# EAGLE design adi-interface(v1) (EAGLE 7.1.0)
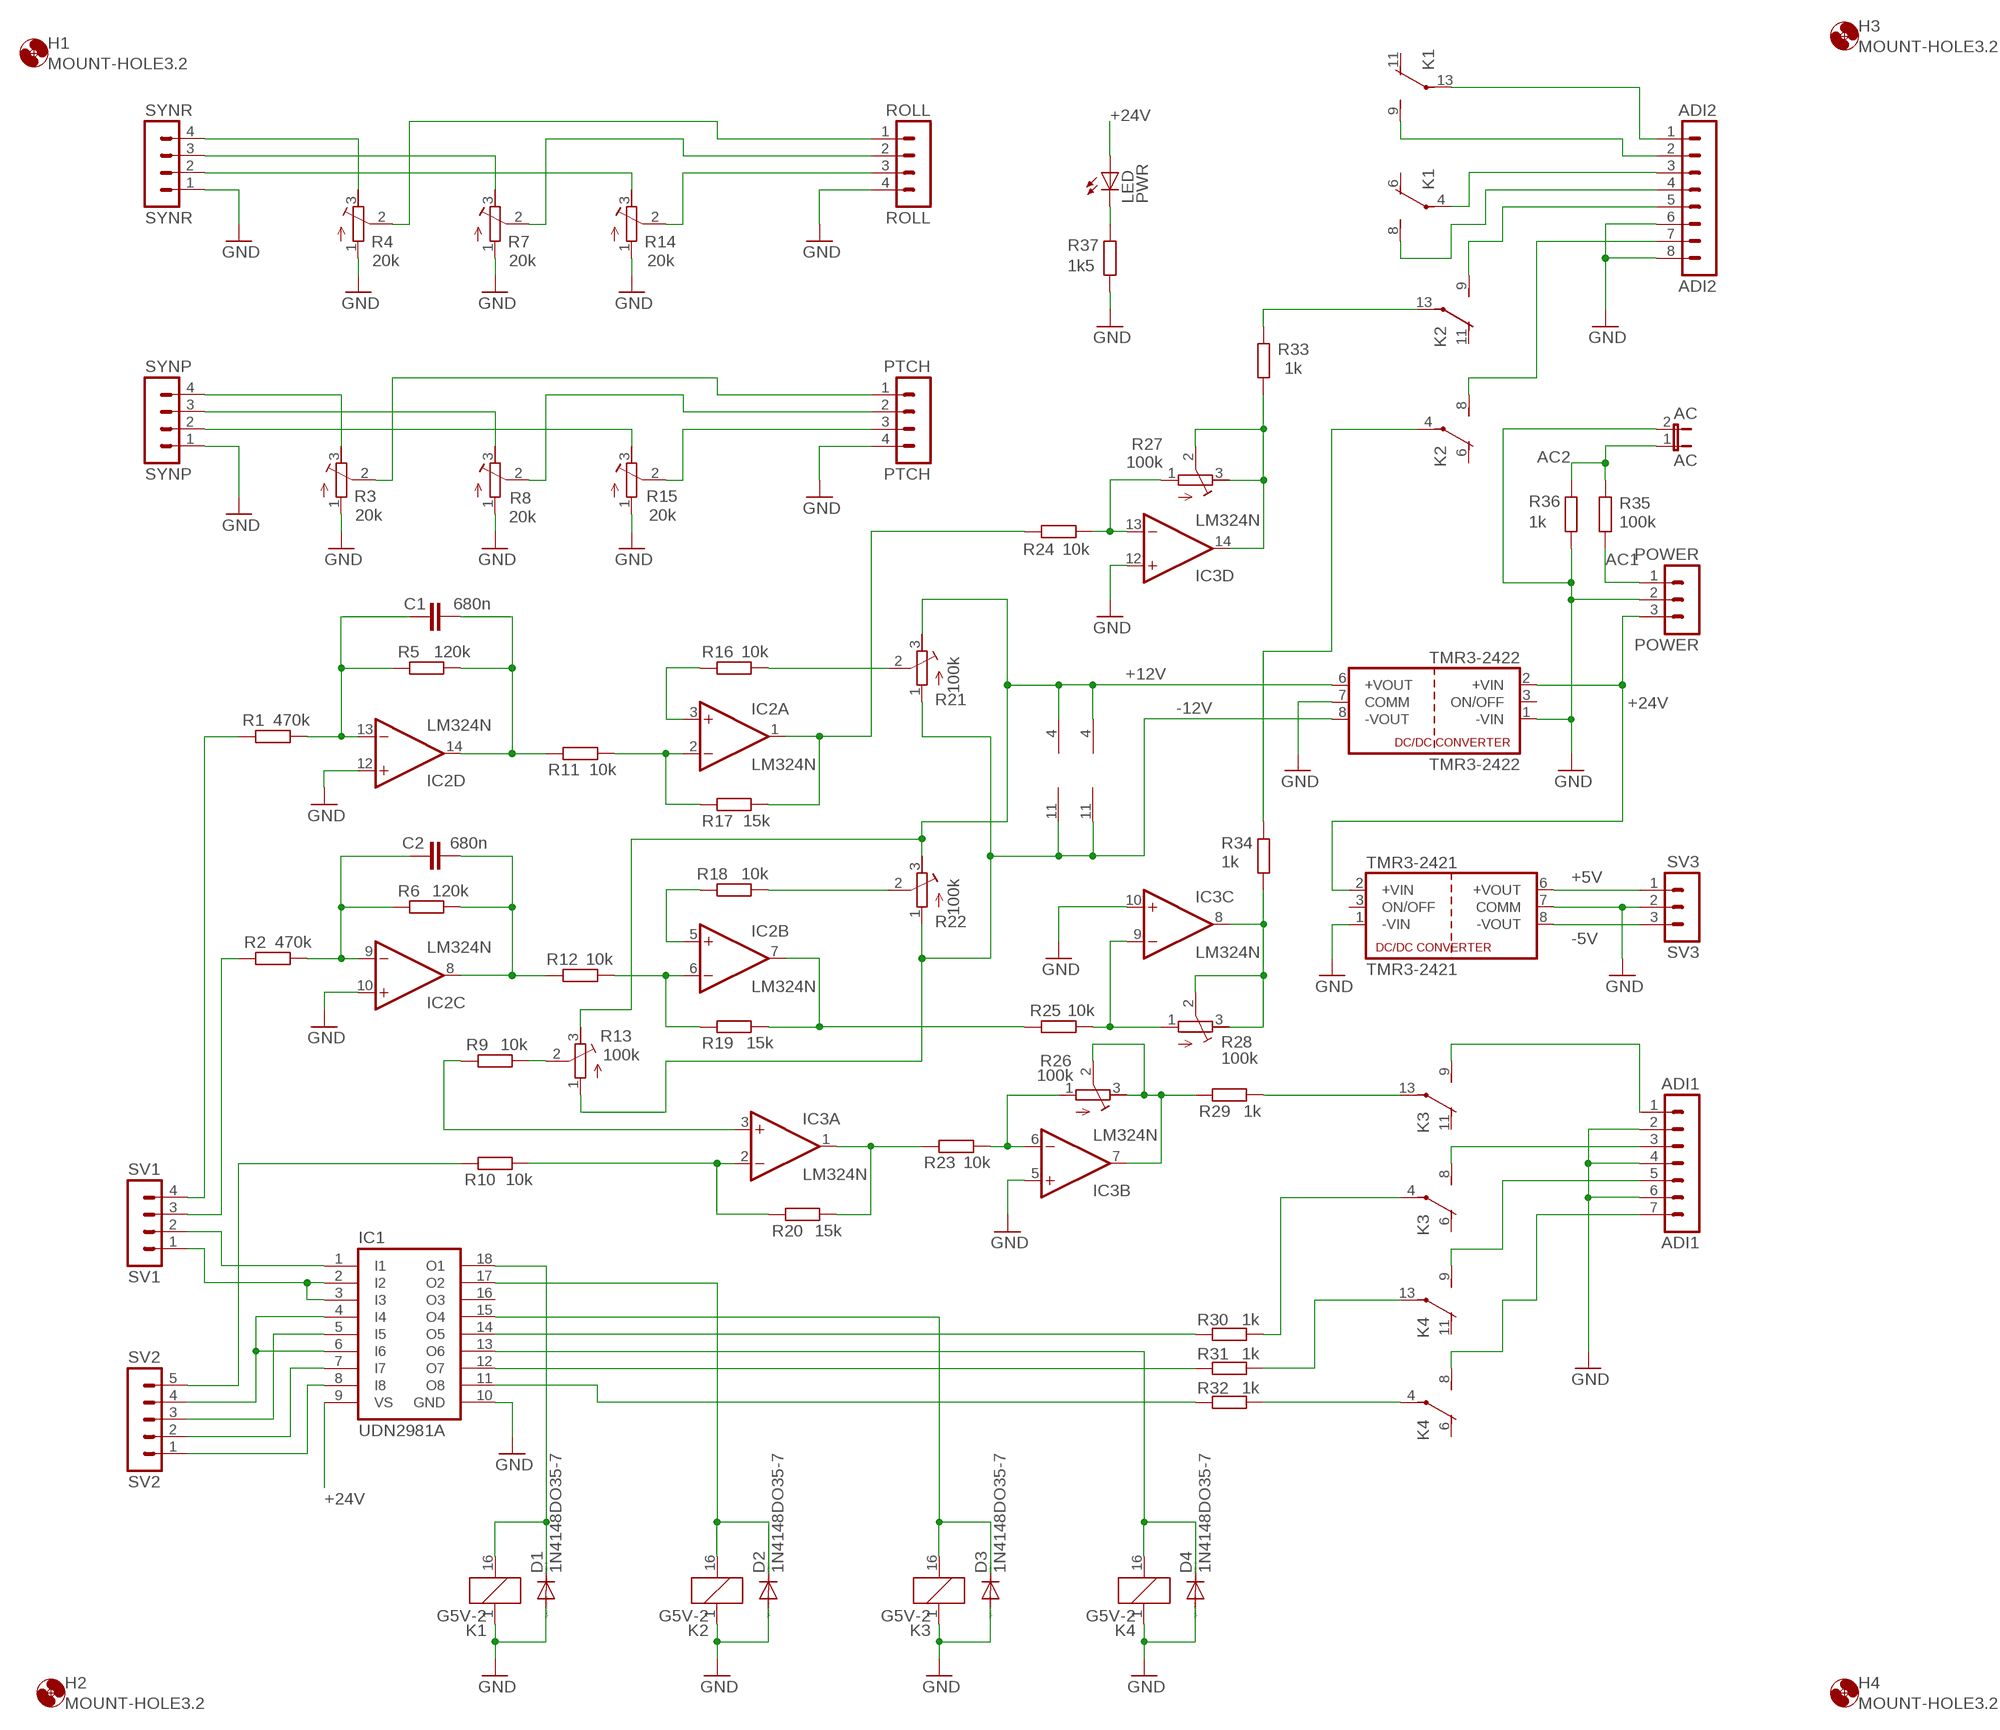
[diagram p0: schematic, sheet 1]

## Parts
AC  AC  JUMPER-2PTH  [1X02]
ADI1  ADI1  MA07-1  [MA07-1]
ADI2  ADI2  MA08-1  [MA08-1]
C1  680n  C-EU050-035X075  [C050-035X075]
C2  680n  C-EU050-035X075  [C050-035X075]
D1  1N4148DO35-7  [DO35-7]
D2  1N4148DO35-7  [DO35-7]
D3  1N4148DO35-7  [DO35-7]
D4  1N4148DO35-7  [DO35-7]
H1  MOUNT-HOLE3.2  [3,2]
H2  MOUNT-HOLE3.2  [3,2]
H3  MOUNT-HOLE3.2  [3,2]
H4  MOUNT-HOLE3.2  [3,2]
IC1  UDN2981A  [DIL18]
IC2  LM324N  [DIL14]
IC3  LM324N  [DIL14]
K1  G5V-2  [G5V-2]
K2  G5V-2  [G5V-2]
K3  G5V-2  [G5V-2]
K4  G5V-2  [G5V-2]
LED  PWR  LED3MM  [LED3MM]
POWER  POWER  MA03-1  [MA03-1]
PTCH  PTCH  MA04-1  [MA04-1]
R1  470k  R-EU_0204/7  [0204/7]
R2  470k  R-EU_0204/7  [0204/7]
R3  20k  R-TRIMM64Z  [RTRIM64Z]
R4  20k  R-TRIMM64Z  [RTRIM64Z]
R5  120k  R-EU_0204/7  [0204/7]
R6  120k  R-EU_0204/7  [0204/7]
R7  20k  R-TRIMM64Z  [RTRIM64Z]
R8  20k  R-TRIMM64Z  [RTRIM64Z]
R9  10k  R-EU_0204/7  [0204/7]
R10  10k  R-EU_0204/7  [0204/7]
R11  10k  R-EU_0204/7  [0204/7]
R12  10k  R-EU_0204/7  [0204/7]
R13  100k  R-TRIMM64Z  [RTRIM64Z]
R14  20k  R-TRIMM64Z  [RTRIM64Z]
R15  20k  R-TRIMM64Z  [RTRIM64Z]
R16  10k  R-EU_0204/7  [0204/7]
R17  15k  R-EU_0204/7  [0204/7]
R18  10k  R-EU_0204/7  [0204/7]
R19  15k  R-EU_0204/7  [0204/7]
R20  15k  R-EU_0204/7  [0204/7]
R21  100k  R-TRIMM64Z  [RTRIM64Z]
R22  100k  R-TRIMM64Z  [RTRIM64Z]
R23  10k  R-EU_0204/7  [0204/7]
R24  10k  R-EU_0204/7  [0204/7]
R25  10k  R-EU_0204/7  [0204/7]
R26  100k  R-TRIMM64Z  [RTRIM64Z]
R27  100k  R-TRIMM64Z  [RTRIM64Z]
R28  100k  R-TRIMM64Z  [RTRIM64Z]
R29  1k  R-EU_0204/7  [0204/7]
R30  1k  R-EU_0204/7  [0204/7]
R31  1k  R-EU_0204/7  [0204/7]
R32  1k  R-EU_0204/7  [0204/7]
R33  1k  R-EU_0204/7  [0204/7]
R34  1k  R-EU_0204/7  [0204/7]
R35  100k  R-EU_0204/7  [0204/7]
R36  1k  R-EU_0204/7  [0204/7]
R37  1k5  R-EU_0204/7  [0204/7]
ROLL  ROLL  MA04-1  [MA04-1]
SV1  SV1  MA04-1  [MA04-1]
SV2  SV2  MA05-1  [MA05-1]
SV3  SV3  MA03-1  [MA03-1]
SYNP  SYNP  MA04-1  [MA04-1]
SYNR  SYNR  MA04-1  [MA04-1]
TMR3-2421  TMR3-2421  TMR  [TRACO_SIP-8]
TMR3-2422  TMR3-2422  TMR  [TRACO_SIP-8]

## Nets
+5V [+5V]: SV3.1 TMR3-2421.6(+VOUT)
+12V [+12V]: IC2.4(P:V+) IC3.4(P:V+) R13.3(E) R21.3(E) R22.3(E) TMR3-2422.6(+VOUT)
+24V [+24V]: IC1.9(VS) LED.A POWER.3 TMR3-2421.2(+VIN) TMR3-2422.2(+VIN)
-5V [-5V]: SV3.3 TMR3-2421.8(-VOUT)
-12V [-12V]: IC2.11(P:V-) IC3.11(P:V-) R13.1(A) R21.1(A) R22.1(A) TMR3-2422.8(-VOUT)
AC1 [AC1]: POWER.1 R35.1
AC2 [AC2]: AC.1 R35.2 R36.2
GND [GND]: AC.2 ADI1.2 ADI1.4 ADI1.6 ADI2.6 ADI2.8 D1.A D2.A D3.A D4.A IC1.10(GND) IC2.10(C:+IN) IC2.12(D:+IN) IC3.5(B:+IN) IC3.10(C:+IN) IC3.12(D:+IN) K1.1 K2.1 K3.1 K4.1 POWER.2 PTCH.4 R3.1(A) R4.1(A) R7.1(A) R8.1(A) R14.1(A) R15.1(A) R36.1 R37.1 ROLL.4 SV3.2 SYNP.1 SYNR.1 TMR3-2421.1(-VIN) TMR3-2421.7(COMM) TMR3-2422.1(-VIN) TMR3-2422.7(COMM)
N$1: R14.3(E) SYNR.2
N$2: R7.3(E) SYNR.3
N$3: R4.3(E) SYNR.4
N$4: R3.3(E) SYNP.4
N$5: R8.3(E) SYNP.3
N$6: R15.3(E) SYNP.2
N$7: R14.2(S) ROLL.3
N$8: R7.2(S) ROLL.2
N$9: R4.2(S) ROLL.1
N$10: PTCH.3 R15.2(S)
N$11: PTCH.2 R8.2(S)
N$12: PTCH.1 R3.2(S)
N$13: ADI2.1 K1.13(2:P)
N$14: ADI2.2 K1.9(2:S)
N$15: ADI2.3 K1.4(1:P)
N$16: ADI2.4 K1.8(1:S)
N$17: ADI2.5 K2.9(2:S)
N$18: ADI2.7 K2.8(1:S)
N$19: D1.C IC1.18(O1) K1.16
N$20: ADI1.1 K3.9(2:S)
N$21: D2.C IC1.17(O2) K2.16
N$22: ADI1.3 K3.8(1:S)
N$23: ADI1.5 K4.9(2:S)
N$24: ADI1.7 K4.8(1:S)
N$25: K3.4(1:P) R30.2
N$26: K4.13(2:P) R31.2
N$27: IC1.2(I2) IC1.3(I3) SV1.1
N$28: IC1.1(I1) SV1.2
N$29: K4.4(1:P) R32.2
N$30: D4.C IC1.13(O6) K4.16
N$31: D3.C IC1.15(O4) K3.16
N$32: IC1.11(O8) R32.1
N$33: IC1.12(O7) R31.1
N$34: R2.1 SV1.3
N$35: C2.1 IC2.9(C:-IN) R2.2 R6.1
N$36: C2.2 IC2.8(C:OUT) R6.2 R12.1
N$37: R1.1 SV1.4
N$38: IC2.2(A:-IN) R11.2 R17.1
N$39: C1.2 IC2.14(D:OUT) R5.2 R11.1
N$40: C1.1 IC2.13(D:-IN) R1.2 R5.1
N$41: K2.13(2:P) R33.2
N$42: IC2.1(A:OUT) R17.2 R24.1
N$43: IC2.6(B:-IN) R12.2 R19.1
N$44: K2.4(1:P) R34.2
N$45: IC2.7(B:OUT) R19.2 R25.1
N$46: IC2.3(A:+IN) R16.1
N$47: IC2.5(B:+IN) R18.1
N$48: R16.2 R21.2(S)
N$49: R18.2 R22.2(S)
N$50: LED.K(C) R37.2
N$52: IC3.6(B:-IN) R23.2 R26.1(A)
N$53: IC3.7(B:OUT) R26.2(S) R26.3(E) R29.1
N$54: IC3.13(D:-IN) R24.2 R27.1(A)
N$55: K3.13(2:P) R29.2
N$56: IC3.1(A:OUT) R20.2 R23.1
N$57: IC3.14(D:OUT) R27.2(S) R27.3(E) R33.1
N$58: R9.2 R13.2(S)
N$59: IC3.9(C:-IN) R25.2 R28.1(A)
N$60: IC3.8(C:OUT) R28.2(S) R28.3(E) R34.1
N$61: IC3.3(A:+IN) R9.1
N$62: R10.1 SV2.5
N$63: IC3.2(A:-IN) R10.2 R20.1
N$64: IC1.14(O5) R30.1
N$65: IC1.4(I4) IC1.6(I6) SV2.4
N$66: IC1.5(I5) SV2.3
N$67: IC1.7(I7) SV2.2
N$68: IC1.8(I8) SV2.1
Unconnected: IC1.16(O3) K1.6(1:O) K1.11(2:O) K2.6(1:O) K2.11(2:O) K3.6(1:O) K3.11(2:O) K4.6(1:O) K4.11(2:O) TMR3-2421.3(ON/OFF) TMR3-2422.3(ON/OFF)

## Library data of the parts
AC = henk:JUMPER-2: Jumper Basic 0.1" spaced jumper. Use with breakaway headers.
ADI1 = con-lstb:MA07-1: PIN HEADER; OC_FARNELL: unknown; OC_NEWARK: unknown
ADI2 = con-lstb:MA08-1: PIN HEADER; OC_FARNELL: unknown; OC_NEWARK: unknown
C1 C2 = rcl:C-EU: CAPACITOR, European symbol
D1-D4 = diode:1N4148: DIODE high speed (Philips)
H1-H4 = holes:MOUNT-HOLE: MOUNTING HOLE with drill center marker
IC1 = uln-udn:UDN298*: DRIVER ARRAY Source: Allegro Microsystems Inc. / UDN2981-UDN2984.pdf
IC2 IC3 = linear:LM324: OP AMP
K1-K4 = relay:G5V-2: OMRON PCB Relay Source: http://www.omron.com/ecb/products/pdf/en-g5v2.pdf; MPN: G5V-2 5DC; OC_FARNELL: 9949488; OC_NEWARK: 78K5703
LED = led:LED: LED OSRAM: - CHIPLED LG R971, LG N971, LY N971, LG Q971, LY Q971, LO R971, LY R971 LH N974, LH R974 LS Q976, LO Q976, LY Q976 LO Q996 - Hyper CHIPLED LW Q18S LB Q993, LB Q99A, LB R99A - SideLED LS A670, LO A670, LY A670, LG A670, LP A670 LB A673, LV A673, LT A673, LW A673 LH A674 LY A675 LS A676, LA A676, LO A676, LY A676, LW A676 LS A679, LY A679, LG A679 - Hyper Micro SIDELED® LS Y876, LA Y876, LO Y876, LY Y876 LT Y87S - SmartLED LW L88C, LW L88S LB L89C, LB L89S, LG L890 LS L89K, LO L89K, LY L89K LS L896, LA L896, LO L896, LY L896 - TOPLED LS T670, LO T670, LY T670, LG T670, LP T670 LSG T670, LSP T670, LSY T670, LOP T670, LYG T670 LG T671, LOG T671, LSG T671 LB T673, LV T673, LT T673, LW T673 LH T674 LS T676, LA T676, LO T676, LY T676, LB T676, LH T676, LSB T676, LW T676 LB T67C, LV T67C, LT T67C, LS T67K, LO T67K, LY T67K, LW E67C LS E67B, LA E67B, LO E67B, LY E67B, LB E67C, LV E67C, LT E67C LW T67C LS T679, LY T679, LG T679 LS T770, LO T770, LY T770, LG T770, LP T770 LB T773, LV T773, LT T773, LW T773 LH T774 LS E675, LA E675, LY E675, LS T675 LS T776, LA T776, LO T776, LY T776, LB T776 LHGB T686 LT T68C, LB T68C - Hyper Mini TOPLED® LB M676 - Mini TOPLED Santana® LG M470 LS M47K, LO M47K, LY M47K Source: http://www.osram.convergy.de LUXEON: - LUMILED® LXK2-PW12-R00, LXK2-PW12-S00, LXK2-PW14-U00, LXK2-PW14-V00 LXK2-PM12-R00, LXK2-PM12-S00, LXK2-PM14-U00 LXK2-PE12-Q00, LXK2-PE12-R00, LXK2-PE12-S00, LXK2-PE14-T00, LXK2-PE14-U00 LXK2-PB12-K00, LXK2-PB12-L00, LXK2-PB12-M00, LXK2-PB14-N00, LXK2-PB14-P00, LXK2-PB14-Q00 LXK2-PR12-L00, LXK2-PR12-M00, LXK2-PR14-Q00, LXK2-PR14-R00 LXK2-PD12-Q00, LXK2-PD12-R00, LXK2-PD12-S00 LXK2-PH12-R00, LXK2-PH12-S00 LXK2-PL12-P00, LXK2-PL12-Q00, LXK2-PL12-R00 Source: www.luxeon.com KINGBRIGHT: KA-3528ASYC Source: www.kingbright.com
POWER SV3 = con-lstb:MA03-1: PIN HEADER; OC_FARNELL: unknown; OC_NEWARK: unknown
PTCH ROLL SV1 SYNP SYNR = con-lstb:MA04-1: PIN HEADER; OC_FARNELL: unknown; OC_NEWARK: unknown
R1 R2 R5 R6 R9-R12 R16-R20 R23-R25 R29-R37 = rcl:R-EU_: RESISTOR, European symbol
R3 R4 R7 R8 R13-R15 R21 R22 R26-R28 = rcl:R-TRIMM: Trimm resistor
SV2 = con-lstb:MA05-1: PIN HEADER; OC_FARNELL: unknown; OC_NEWARK: unknown
TMR3-2421 TMR3-2422 = traco-tmr-dual:TMR

## Net classes
0 default: width 0.254 mm, clearance 0.254 mm
1 GND: width 1.016 mm, clearance 0.254 mm
2 +12V: width 0.508 mm, clearance 0.254 mm
3 -12V: width 0.508 mm, clearance 0.254 mm
4 +5V: width 0.762 mm, clearance 0.254 mm
5 -5V: width 0.762 mm, clearance 0.254 mm
6 +24V: width 1.016 mm, clearance 0.254 mm
7 AC1: width 0.254 mm, clearance 1.016 mm
8 AC2: width 0.254 mm, clearance 0.508 mm

## Board
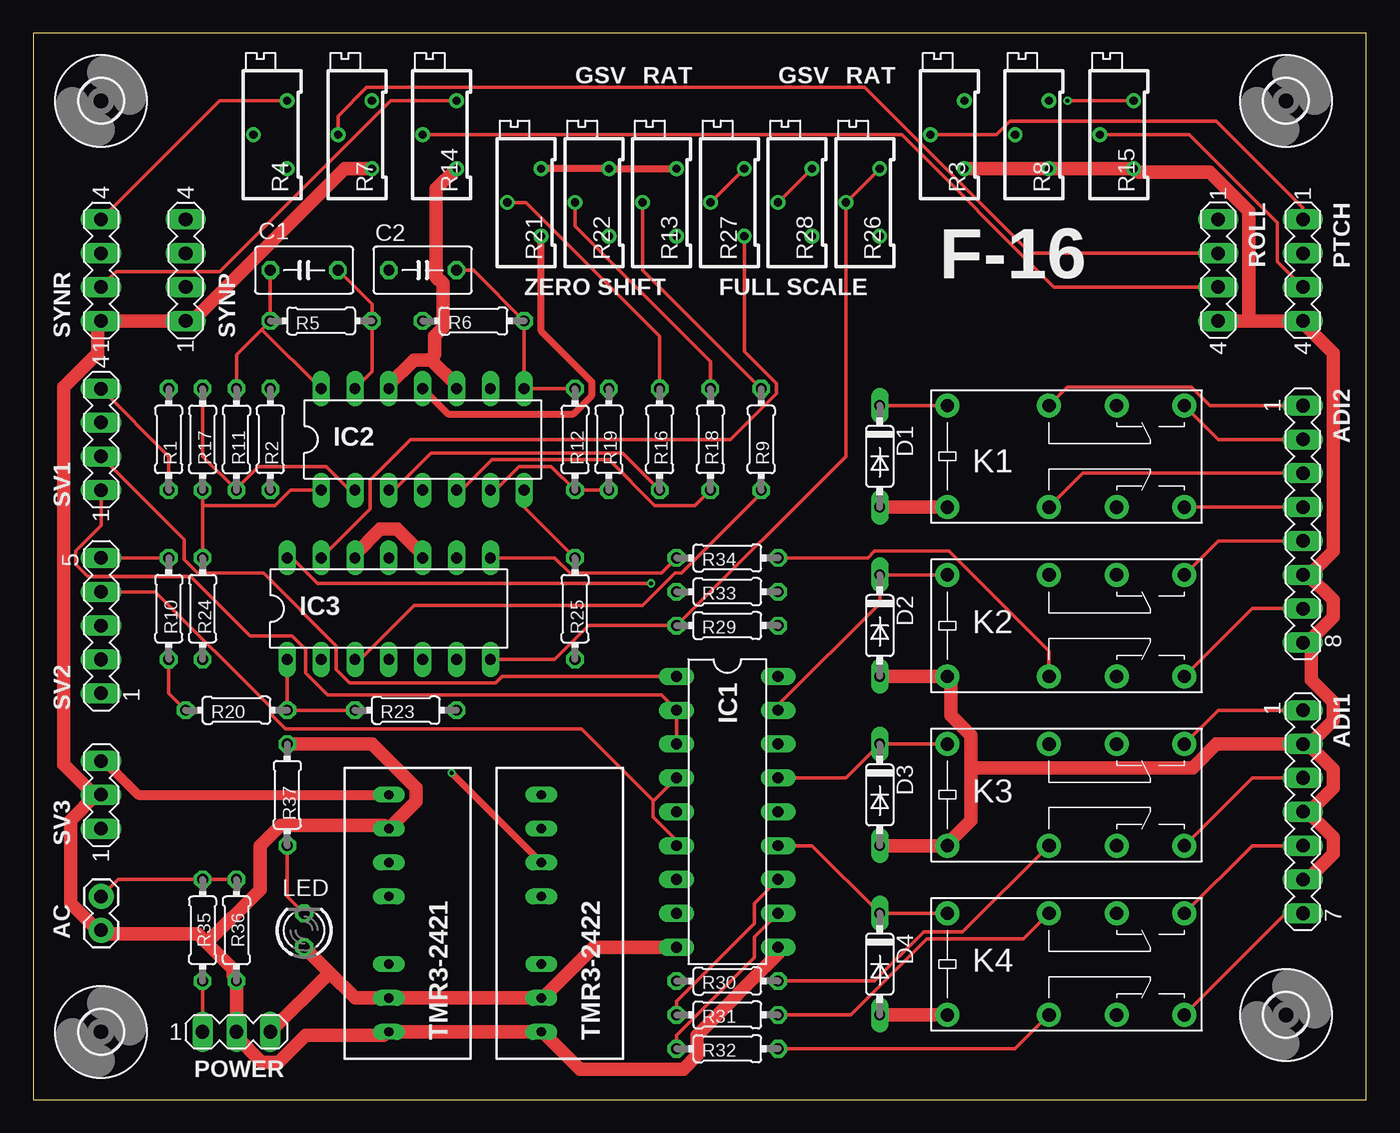
[diagram p1: board, top side]
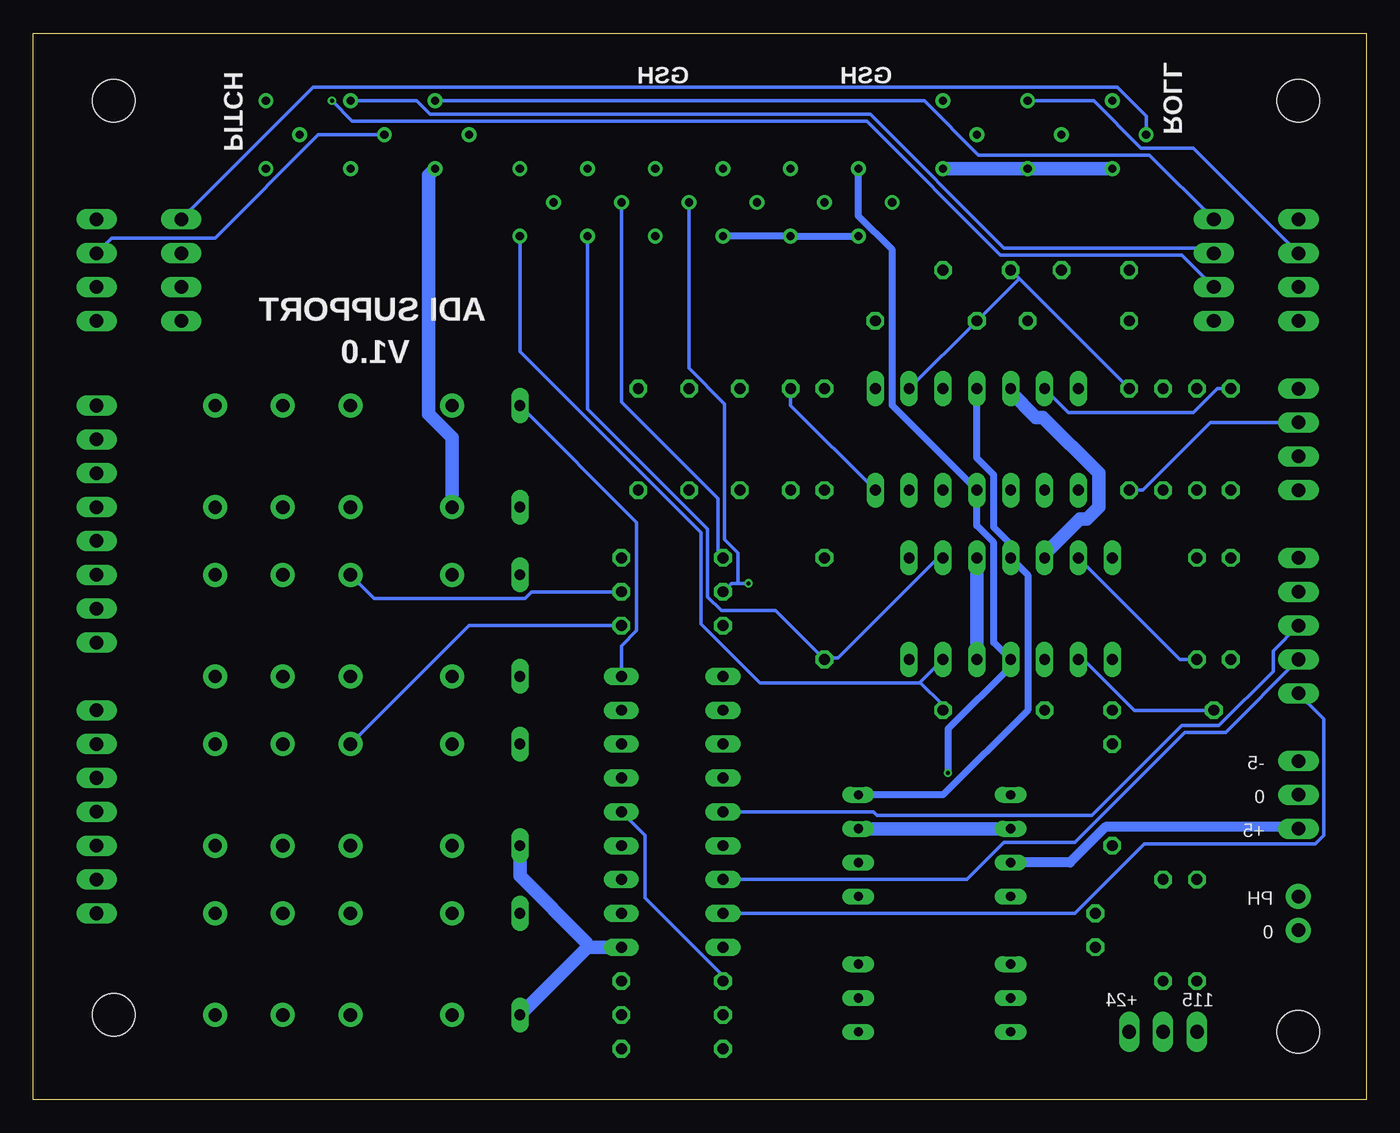
[diagram p2: board, bottom side, seen from below]

Size 100 x 80 mm. Coordinates in mm from the lower left corner, seen from the top.
Outline: 0,0 100,0 100,80 0,80 0,0
Copper layers (1*16): Top 0.035mm / dielectric 1.5mm / Bottom 0.035mm
Design rules "ITEADstudio_DRC": minimum track width 6mil, minimum drill 12mil, track to track 6mil, track to pad 6mil, pad to pad 6mil, via to via 6mil, smd to smd 0mil, copper to edge 10mil, drill to drill 10mil, minimum pad ring 10mil, minimum via ring 6mil, stop-mask expansion 2mil, vias tented up to drill 100mil, thermal gap 10mil

### Footprints (pad centres in the part's own frame; a part is rotated, then mirrored left to right if it is on the bottom)
1X02 = drill 1.016 pad 1.88: 1 0,0; 2 2.54,0
MA07-1 = drill 1.016 long: 1 -7.62,0; 2 -5.08,0; 3 -2.54,0; 4 0,0; 5 2.54,0; 6 5.08,0; 7 7.62,0
MA08-1 = drill 1.016 long: 1 -8.89,0; 2 -6.35,0; 3 -3.81,0; 4 -1.27,0; 5 1.27,0; 6 3.81,0; 7 6.35,0; 8 8.89,0
C050-035X075 = drill 0.813 octagon: 1 -2.54,0; 2 2.54,0
DO35-7 = drill 0.813 long: A 3.81,0; C -3.81,0
3,2 = hole 3.2: 0,0
DIL18 = drill 0.813 long: 1 -10.16,-3.81; 2 -7.62,-3.81; 3 -5.08,-3.81; 4 -2.54,-3.81; 5 0,-3.81; 6 2.54,-3.81; 7 5.08,-3.81; 8 7.62,-3.81; 9 10.16,-3.81; 10 10.16,3.81; 11 7.62,3.81; 12 5.08,3.81; 13 2.54,3.81; 14 0,3.81; 15 -2.54,3.81; 16 -5.08,3.81; 17 -7.62,3.81; 18 -10.16,3.81
DIL14 = drill 0.813 long: 1 -7.62,-3.81; 2 -5.08,-3.81; 3 -2.54,-3.81; 4 0,-3.81; 5 2.54,-3.81; 6 5.08,-3.81; 7 7.62,-3.81; 8 7.62,3.81; 9 5.08,3.81; 10 2.54,3.81; 11 0,3.81; 12 -2.54,3.81; 13 -5.08,3.81; 14 -7.62,3.81
G5V-2 = drill 1 pad 1.8: 1 -8.89,-3.81; 4 -1.27,-3.81; 6 3.81,-3.81; 8 8.89,-3.81; 9 8.89,3.81; 11 3.81,3.81; 13 -1.27,3.81; 16 -8.89,3.81
LED3MM = drill 0.813 octagon: A -1.27,0; K 1.27,0
MA03-1 = drill 1.016 long: 1 -2.54,0; 2 0,0; 3 2.54,0
MA04-1 = drill 1.016 long: 1 -3.81,0; 2 -1.27,0; 3 1.27,0; 4 3.81,0
0204/7 = drill 0.813 octagon: 1 -3.81,0; 2 3.81,0
RTRIM64Z = drill 0.61: 1 0,-2.54; 2 -2.54,0; 3 0,2.54
MA05-1 = drill 1.016 long: 1 -5.08,0; 2 -2.54,0; 3 0,0; 4 2.54,0; 5 5.08,0
TRACO_SIP-8 = drill 0.7 long: 1 -8.89,0; 2 -6.35,0; 3 -3.81,0; 5 1.27,0; 6 3.81,0; 7 6.35,0; 8 8.89,0

### Placement (x,y rotation side)
AC  5.08,15.24 270 top
ADI1  95.25,21.59 270 top
ADI2  95.25,43.18 270 top
C1  20.32,62.23 180 top
C2  29.21,62.23 0 top
D1  63.5,48.26 270 top
D2  63.5,35.56 270 top
D3  63.5,22.86 270 top
D4  63.5,10.16 270 top
H1  5.08,74.93 0 top
H2  5.08,5.08 0 top
H3  93.98,6.35 0 top
H4  93.98,74.93 0 top
IC1  52.07,21.59 270 top
IC2  29.21,49.53 0 top
IC3  26.67,36.83 0 top
K1  77.47,48.26 0 top
K2  77.47,35.56 0 top
K3  77.47,22.86 0 top
K4  77.47,10.16 0 top
LED  20.32,12.7 90 top
POWER  15.24,5.08 0 top
PTCH  95.25,62.23 270 top
R1  10.16,49.53 90 top
R2  17.78,49.53 90 top
R3  69.85,72.39 0 top
R4  19.05,72.39 0 top
R5  21.59,58.42 180 top
R6  33.02,58.42 0 top
R7  25.4,72.39 0 top
R8  76.2,72.39 0 top
R9  54.61,49.53 90 top
R10  10.16,36.83 270 top
R11  15.24,49.53 270 top
R12  40.64,49.53 270 top
R13  48.26,67.31 0 top
R14  31.75,72.39 0 top
R15  82.55,72.39 0 top
R16  46.99,49.53 90 top
R17  12.7,49.53 270 top
R18  50.8,49.53 90 top
R19  43.18,49.53 90 top
R20  15.24,29.21 0 top
R21  38.1,67.31 0 top
R22  43.18,67.31 0 top
R23  27.94,29.21 0 top
R24  12.7,36.83 270 top
R25  40.64,36.83 270 top
R26  63.5,67.31 0 top
R27  53.34,67.31 0 top
R28  58.42,67.31 0 top
R29  52.07,35.56 0 top
R30  52.07,8.89 0 top
R31  52.07,6.35 0 top
R32  52.07,3.81 0 top
R33  52.07,38.1 0 top
R34  52.07,40.64 0 top
R35  12.7,12.7 90 top
R36  15.24,12.7 90 top
R37  19.05,22.86 270 top
ROLL  88.9,62.23 270 top
SV1  5.08,49.53 90 top
SV2  5.08,35.56 90 top
SV3  5.08,22.86 90 top
SYNP  11.43,62.23 90 top
SYNR  5.08,62.23 90 top
TMR3-2421  26.67,13.97 90 top
TMR3-2422  38.1,13.97 90 top

### Tracks (layer width: path | path; a pad name or v marks a point on that pad's centre or on a via)
+5V
  Bottom 0.762: TMR3-2421.6 22.23,17.78 19.56,20.45 5.21,20.45 SV3.1
+12V  (via drill 0.3)
  Top 0.508: R21.3 R22.3 R13.3 | v31.37,24.51 TMR3-2422.6
  Bottom 0.508: v31.37,24.51 31.37,27.81 26.67,32.51 IC3.4 27.94,34.29 27.94,41.78 29.21,43.05 IC2.4 35.56,52.07 35.56,63.75 38.1,66.29 R21.3
+24V
  Top 1.016: LED.A 22.23,9.53 | 22.23,9.53 24.13,7.62 TMR3-2421.2 TMR3-2422.2 38.48,7.87 42.04,11.43 IC1.9 | 22.23,9.53 POWER.3
-5V
  Top 0.762: TMR3-2421.8 7.87,22.86 5.33,25.4 SV3.3
-12V
  Top 0.508: R21.1 38.1,57.66 41.91,53.85 41.91,52.83 40.51,51.44 31.11,51.44 IC2.11
  Bottom 0.508: R21.1 R22.1 R13.1 | TMR3-2422.8 31.75,22.86 25.4,29.21 25.4,39.37 IC3.11 26.8,40.77 26.8,41.78 27.94,42.93 27.94,46.86 29.21,48.13 IC2.11
AC1
  Top 0.254: POWER.1 R35.1
AC2
  Top 0.254: R36.2 R35.2 6.35,16.51 AC.1
GND
  Top 1.016: ADI1.6 95.63,16.51 97.54,18.41 97.54,19.68 95.63,21.59 ADI1.4 96.01,21.84 97.54,23.37 97.54,24.77 95.63,26.67 ADI1.2 | ADI1.2 96.01,26.92 97.54,28.45 97.54,29.84 95.89,31.5 95.89,33.91 ADI2.8 95.63,34.29 97.54,36.2 97.54,37.47 95.63,39.37 ADI2.6 96.01,39.62 97.54,41.15 97.54,56.01 95.5,58.04 PTCH.4 91.19,58.42 | 91.19,58.42 ROLL.4 | K1.1 D1.A | R3.1 R8.1 R15.1 82.93,69.6 88.27,69.6 91.19,66.67 91.19,58.42 | IC3.12 24.13,40.89 26.04,42.8 27.3,42.8 29.21,40.89 IC3.10 | IC2.12 26.67,53.59 28.57,55.5 29.84,55.5 | 29.84,55.5 31.75,53.59 IC2.10 | R14.1 30.23,68.33 30.23,61.72 30.73,61.21 30.73,57.91 30.1,57.28 30.1,55.88 29.84,55.5 | R7.1 23.37,69.85 12.19,58.67 11.81,58.67 SYNP.1 SYNR.1 4.83,58.04 4.83,56.01 2.29,53.47 2.29,25.15 4.32,23.11 SV3.2 4.7,22.86 2.79,20.95 2.79,14.73 4.83,12.7 AC.2 5.46,12.45 12.32,12.45 13.02,11.75 | D2.A K2.1 68.83,31.37 68.83,28.83 70.36,27.3 70.36,24.89 | D3.A K3.1 68.83,19.43 70.36,20.95 70.36,24.89 | K4.1 D4.A | R37.1 25.4,26.67 28.7,23.37 28.7,22.35 TMR3-2421.7 26.29,20.57 18.54,20.57 17.02,19.05 17.02,15.75 13.02,11.75 | 13.02,11.75 14.99,9.78 14.99,9.27 R36.1 POWER.2 15.24,4.7 17.14,2.79 18.41,2.79 20.45,4.83 26.29,4.83 TMR3-2421.1 TMR3-2422.1 38.48,4.83 41.02,2.29 48.77,2.29 49.78,3.3 49.78,4.83 55.88,10.92 IC1.10 | ADI1.2 88.77,26.67 87,24.89 70.36,24.89
  Bottom 1.016: K1.1 68.58,49.66 70.36,51.44 70.36,69.34 R3.1 | IC3.10 IC3.5 | R4.1 R7.1 R14.1 | IC3.12 24.13,40.89 21.46,43.56 20.95,43.56 20.07,44.45 20.07,46.99 24.26,51.18 24.77,51.18 26.67,53.09 IC2.12 | 58.42,11.43 IC1.10 | D4.A 58.42,11.43 | D3.A 63.5,16.76 58.55,11.81 58.42,11.43 | TMR3-2422.7 TMR3-2421.7
N$1
  Top 0.254: R14.3 26.8,74.93 13.97,62.1 6.22,62.1 SYNR.2
N$2
  Bottom 0.254: R7.3 20.45,74.93 16.89,71.37 12.95,71.37 SYNR.3
N$3
  Top 0.254: R4.3 13.97,74.93 SYNR.4
N$4
  Bottom 0.254: R3.3 33.15,74.93 29.08,70.87 16.26,70.87 SYNP.4
N$5
  Bottom 0.254: R8.3 71.25,74.93 70.23,73.91 37.21,73.91 27.18,63.88 11.81,63.88 SYNP.3
N$6  (via drill 0.3)
  Top 0.254: v77.6,74.93 R15.3
  Bottom 0.254: v77.6,74.93 76.07,73.41 37.47,73.41 27.43,63.37 13.84,63.37 SYNP.2
N$7
  Top 0.254: R14.2 65.15,72.39 76.58,60.96 ROLL.3
N$8
  Top 0.254: R7.2 22.86,73.79 25.02,75.95 62.36,75.95 74.8,63.5 ROLL.2
N$9
  Bottom 0.254: R4.2 16.51,73.79 18.67,75.95 78.99,75.95 ROLL.1
N$10
  Top 0.254: R15.2 86.74,72.39 93.34,65.79 93.34,62.87 PTCH.3
N$11
  Bottom 0.254: R8.2 78.61,72.39 86.36,64.64 94.11,64.64 PTCH.2
N$12
  Top 0.254: R3.2 72.26,72.39 73.28,73.41 88.77,73.41 95.25,66.93 PTCH.1
N$13
  Top 0.254: ADI2.1 88.27,52.07 86.87,53.47 77.6,53.47 K1.13
N$14
  Top 0.254: ADI2.2 88.9,49.53 K1.9
N$15
  Top 0.254: ADI2.3 78.74,46.99 K1.4
N$16
  Top 0.254: K1.8 ADI2.4
N$17
  Top 0.254: ADI2.5 88.9,41.91 K2.9
N$18
  Top 0.254: ADI2.7 91.44,36.83 K2.8
N$19
  Top 0.254: D1.C K1.16
  Bottom 0.254: IC1.18 55.88,34.04 54.74,35.18 54.74,43.31 D1.C
N$20
  Top 0.254: ADI1.1 88.9,29.21 K3.9
N$21
  Top 0.254: IC1.17 55.88,29.59 63.5,37.21 D2.C K2.16
N$22
  Top 0.254: ADI1.3 91.44,24.13 K3.8
N$23
  Top 0.254: ADI1.5 91.44,19.05 K4.9
N$24
  Top 0.254: ADI1.7 93.98,13.97 K4.8
N$25
  Top 0.254: R30.2 63.12,8.89 66.8,12.57 69.72,12.57 K3.4
N$26
  Top 0.254: R31.2 61.34,6.35 67.06,12.06 74.3,12.06 K4.13
N$27
  Top 0.254: IC1.3 IC1.2 47.12,30.35 22.1,30.35 20.45,32 20.45,33.78 19.43,34.8 16.26,34.8 11.81,39.24 4.06,39.24 3.17,40.13 3.17,41.15 5.08,43.05 SV1.1
N$28
  Top 0.254: IC1.1 35.18,31.75 34.67,31.24 23.75,31.24 22.73,32.26 22.73,34.04 17.27,39.5 12.32,39.5 11.3,40.51 11.3,42.04 SV1.2
N$29
  Top 0.254: R32.2 73.66,3.81 K4.4
N$30
  Top 0.254: K4.16 D4.C 58.42,19.05 IC1.13
N$31
  Top 0.254: IC1.15 60.96,24.13 D3.C K3.16
N$32
  Top 0.254: R32.1 48.26,4.83 54.1,10.67 54.1,12.19 IC1.11
N$33
  Top 0.254: R31.1 48.26,7.37 54.1,13.21 54.1,14.73 IC1.12
N$34
  Bottom 0.254: R2.1 16.76,45.72 11.68,50.8 SV1.3
N$35
  Bottom 0.254: C2.1 26.04,61.59 | 26.04,61.59 R2.2 | 26.04,61.59 R6.1 IC2.9
N$36
  Top 0.254: R12.1 IC2.8 R6.2 33.02,62.23 C2.2
N$37
  Top 0.254: R1.1 10.16,48.26 SV1.4
N$38
  Top 0.254: R17.1 12.7,48.26 R11.2 15.24,45.85 16.89,47.5 21.97,47.5 23.75,45.72 IC2.2
N$39
  Top 0.254: R11.1 15.24,55.88 17.14,57.78 | 17.14,57.78 R5.2 C1.2 | 17.14,57.78 IC2.14
N$40
  Top 0.254: C1.1 25.4,59.69 R5.1 25.4,54.61 IC2.13
  Bottom 0.254: R1.2 11.18,53.34 12.95,51.56 22.35,51.56 IC2.13
N$41
  Bottom 0.254: R33.2 62.61,38.1 63.12,37.59 74.42,37.59 K2.13
N$42
  Top 0.254: R17.2 12.7,44.58 | 12.7,44.58 R24.1 | IC2.1 19.3,45.72 18.16,44.58 12.7,44.58
N$43
  Top 0.254: IC2.6 34.67,45.72 36.45,47.5 38.86,47.5 R12.2 R19.1
N$44
  Top 0.254: R34.2 62.61,40.64 63.12,41.15 68.71,41.15 76.2,33.66 K2.4
N$45
  Top 0.254: IC2.7 36.83,44.45 R25.1
  Bottom 0.254: R19.2 43.18,52.07 IC2.7
N$46
  Top 0.254: IC2.3 27.05,45.72 29.84,48.51 44.2,48.51 R16.1
N$47
  Top 0.254: IC2.5 32.13,45.72 34.42,48.01 43.18,48.01 46.61,44.58 49.66,44.58 R18.1
N$48
  Top 0.254: R21.2 36.96,67.31 46.99,57.28 R16.2
N$49
  Top 0.254: R22.2 40.64,65.53 50.8,55.37 R18.2
N$50
  Top 0.254: R37.2 19.05,15.24 LED.K
N$52
  Bottom 0.254: R26.1 63.5,56.13 49.91,42.55 49.91,35.69 45.47,31.24 33.53,31.24 33.47,31.3 | IC3.6 33.47,31.3 | R23.2 31.75,29.59 33.47,31.3
N$53
  Top 0.254: R26.3 R26.2 60.96,48.26 R29.1 41.66,35.56 39.12,33.02 IC3.7
N$54
  Top 0.254: R27.1 53.34,56.13 55.75,53.72 55.75,52.96 52.32,49.53 28.32,49.53 25.27,46.48 25.27,44.32 IC3.13
  Bottom 0.254: R24.2 13.97,33.02 IC3.13
N$55
  Bottom 0.254: R29.2 67.31,35.56 K3.13
N$56
  Top 0.254: IC3.1 R20.2 R23.1
N$57  (via drill 0.3)
  Top 0.254: R27.3 R27.2 | IC3.14 19.43,40.64 21.34,38.73 v46.35,38.73
  Bottom 0.254: 47.12,38.73 47.62,38.73 R33.1 | 47.12,38.73 v46.35,38.73 | R27.2 50.8,54.86 48.13,52.2 48.13,42.04 47.12,41.02 47.12,38.73
N$58
  Top 0.254: R13.2 45.72,62.23 R9.2
N$59
  Bottom 0.254: R28.1 58.42,51.82 49.4,42.8 49.4,37.72 48.39,36.7 44.32,36.7 R25.2 40.64,33.15 39.62,33.15 32.13,40.64 IC3.9
N$60
  Top 0.254: R28.3 R28.2 | IC3.8 39.12,40.64 40.26,39.5 47.12,39.5 R34.1
  Bottom 0.254: R28.2 55.88,52.32 48.64,45.09 48.64,41.02 R34.1
N$61
  Top 0.254: IC3.3 24.51,33.02 28.57,37.08 45.72,37.08 48.13,39.5 48.64,39.5 54.61,45.47 R9.1
N$62
  Top 0.254: SV2.5 R10.1
N$63
  Top 0.254: R10.2 10.16,30.48 R20.1
  Bottom 0.254: IC3.2 21.21,33.02 17.4,29.21 R20.1
N$64
  Bottom 0.254: R30.1 48.26,9.27 54.1,15.11 54.1,19.81 IC1.14
N$65
  Top 0.254: IC1.6 48.26,19.43 46.48,21.21 46.48,22.35 46.55,22.42 | IC1.4 46.55,22.42 | SV2.4 9.14,38.1 17.91,29.34 17.91,28.83 18.92,27.81 41.15,27.81 46.55,22.42
N$66
  Bottom 0.254: IC1.5 36.96,21.59 36.7,21.34 20.57,21.34 13.84,28.07 11.05,28.07 6.99,32.13 6.99,33.66 SV2.3
N$67
  Bottom 0.254: IC1.7 29.97,16.51 27.18,19.3 21.84,19.3 13.59,27.56 10.54,27.56 SV2.2
N$68
  Bottom 0.254: IC1.8 21.84,13.97 16.64,19.18 3.81,19.18 3.17,19.81 3.17,28.57 SV2.1

### Text on the board
tNames: GSV | RAT | GSV | RAT | F-16 | ZERO SHIFT | FULL SCALE | TMR3-2421 | TMR3-2422
bNames: GSH | GSH | ROLL | PITCH | ADI SUPPORT | V1.0 | -5 | 0 | +5 | PH | 0 | 115 | +24